# EAGLE schematic RT5350F_OLinuXino_EVB_Rev_C (EAGLE 4.16)
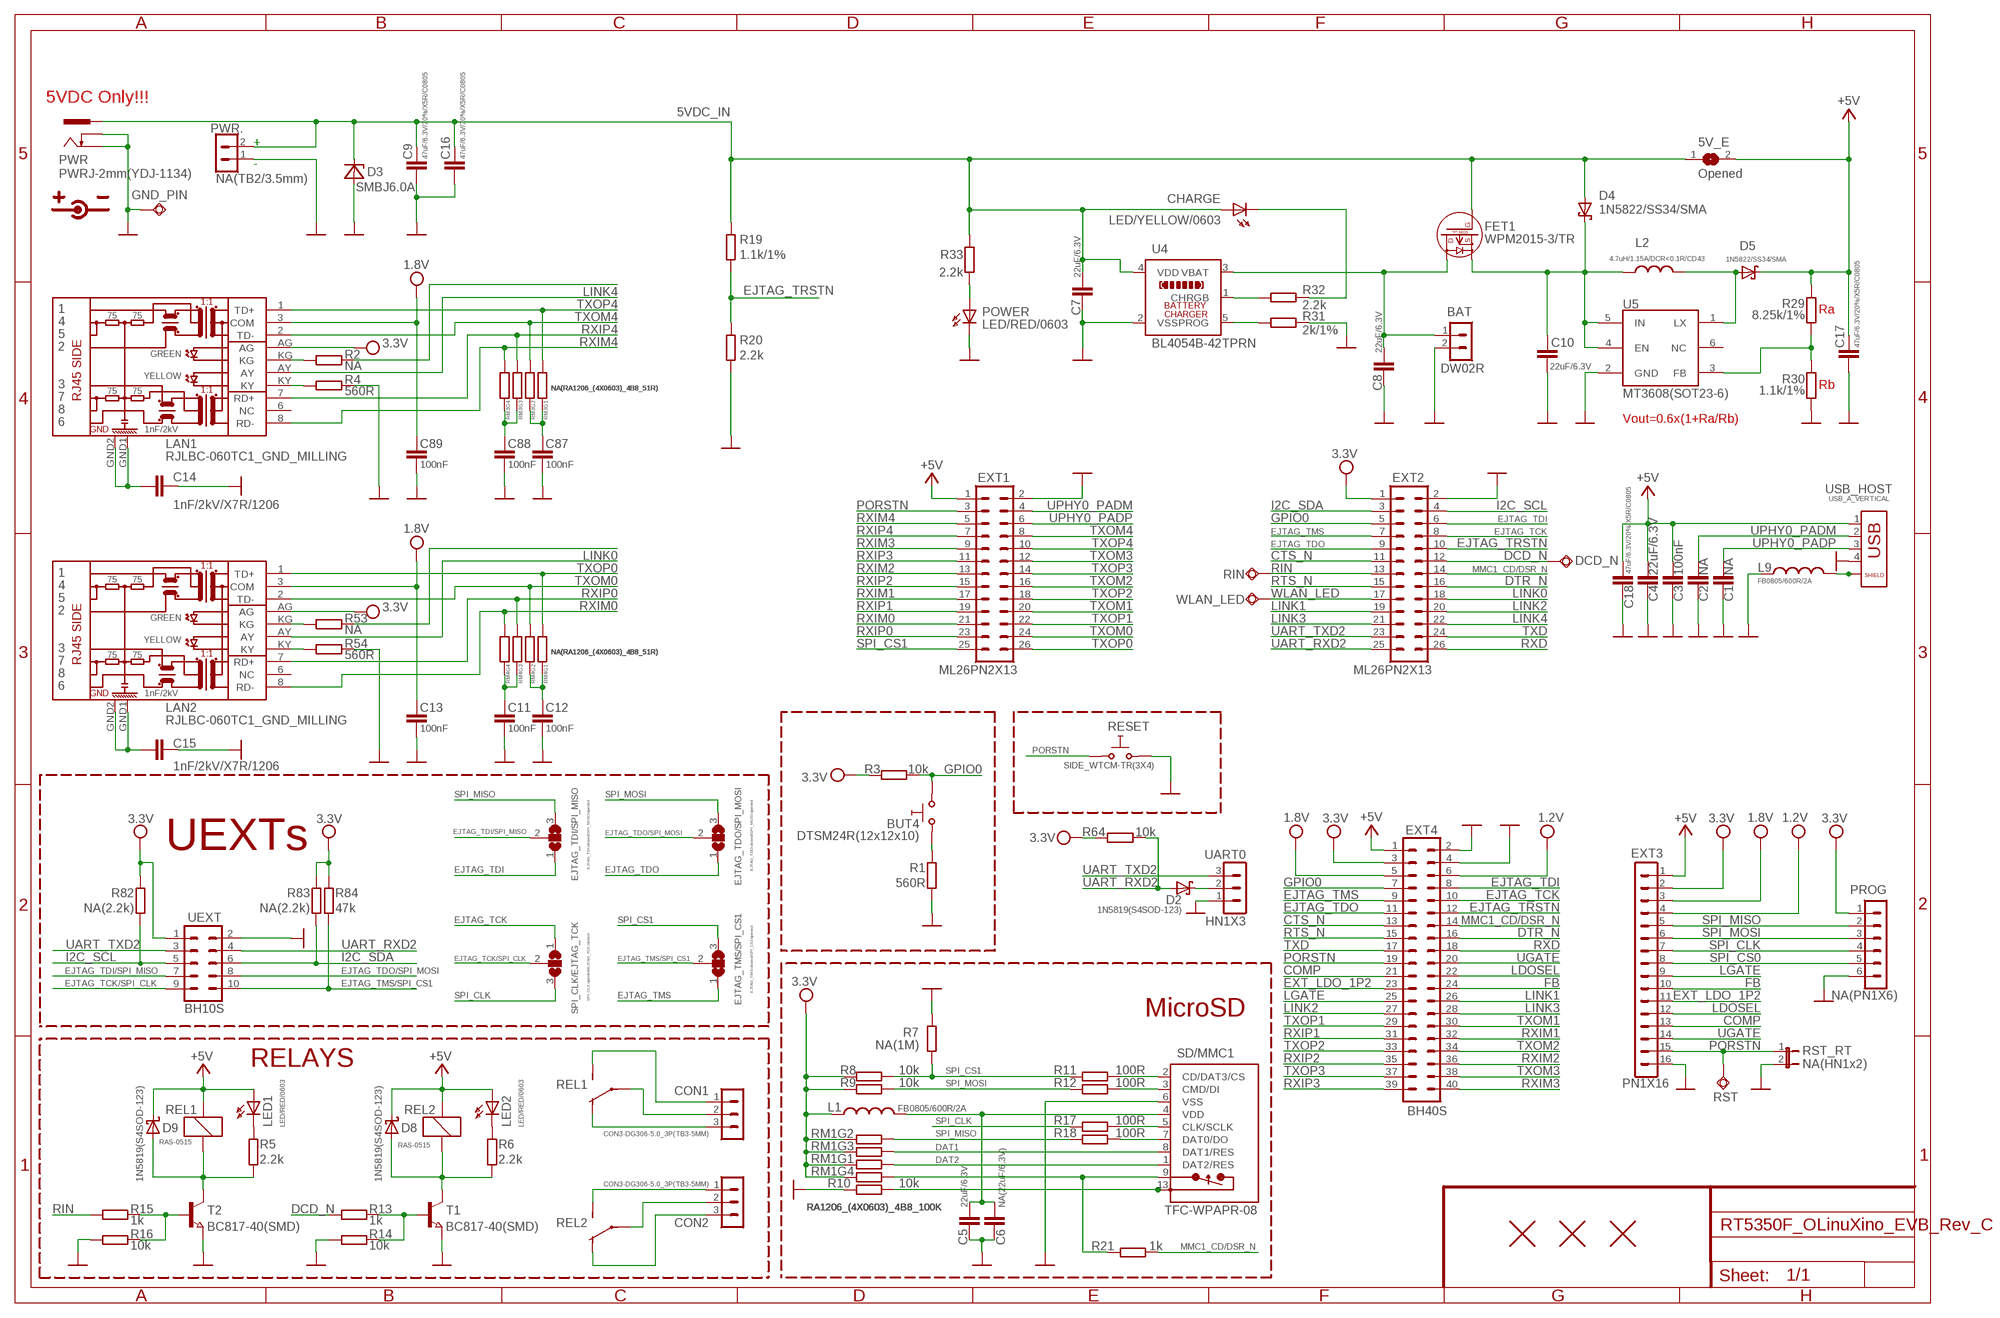
[diagram p0: schematic, sheet 1]

## Parts
5V_E  Opened  SJ_SMALLER  [SJ_1_SMALLER]
BAT  DW02R  CON2DW02R  [DW02R]
BUT4  DTSM24R(12x12x10)  SW-TAKTSS  [SW_TAKT12X12SS]
C1  NA  C-EUC0402_TI  [C0402_TI]
C2  NA  C-EUC0402_TI  [C0402_TI]
C3  100nF  C-EUC0603_DWS  [C0603_DWS]
C4  22uF/6.3V  C-EUC0603_DWS  [C0603_DWS]
C5  22uF/6.3V  C-EUC0603_DWS  [C0603_DWS]
C6  NA(22uF/6.3V)  C-EUC0603_DWS  [C0603_DWS]
C7  22uF/6.3V  C-EUC0603_DWS  [C0603_DWS]
C8  22uF/6.3V  C-EUC0603_DWS  [C0603_DWS]
C9  47uF/6.3V/20%/X5R/C0805  C-EUC0805_5MIL_DWS  [C0805_5MIL_DWS]
C10  22uF/6.3V  C-EUC0603_DWS  [C0603_DWS]
C11  100nF  C-EUC0603_DWS  [C0603_DWS]
C12  100nF  C-EUC0603_DWS  [C0603_DWS]
C13  100nF  C-EUC0603_DWS  [C0603_DWS]
C14  1nF/2kV/X7R/1206  C-EUC1206_5MILS_WS_ISO  [C1206_5MILS_WS_ISO]
C15  1nF/2kV/X7R/1206  C-EUC1206_5MILS_WS_ISO  [C1206_5MILS_WS_ISO]
C16  47uF/6.3V/20%/X5R/C0805  C-EUC0805_5MIL_DWS  [C0805_5MIL_DWS]
C17  47uF/6.3V/20%/X5R/C0805  C-EUC0805_5MIL_DWS  [C0805_5MIL_DWS]
C18  47uF/6.3V/20%/X5R/C0805  C-EUC0805_5MIL_DWS  [C0805_5MIL_DWS]
C87  100nF  C-EUC0603_DWS  [C0603_DWS]
C88  100nF  C-EUC0603_DWS  [C0603_DWS]
C89  100nF  C-EUC0603_DWS  [C0603_DWS]
CHARGE  LED/YELLOW/0603  LED0603DWS  [LED-0603]
CON1  CON3-DG306-5.0_3P(TB3-5MM)  [DG306-5.0_3P]
CON2  CON3-DG306-5.0_3P(TB3-5MM)  [DG306-5.0_3P]
D2  1N5819(S4SOD-123)  SCHOTKKY7.62SS-1N5819(S4SOD-123)  [SOD-123]
D3  SMBJ6.0A  SMBJ16A  [DO214AA]
D4  1N5822/SS34/SMA  SCHOTKKY7.62SS2  [MLL-41]
D5  1N5822/SS34/SMA  SCHOTKKY7.62SS2  [MLL-41]
D8  1N5819(S4SOD-123)  SCHOTKKY7.62SS-1N5819(S4SOD-123)  [SOD-123]
D9  1N5819(S4SOD-123)  SCHOTKKY7.62SS-1N5819(S4SOD-123)  [SOD-123]
DCD_N  TESTPAD40/70  [TESTPAD]
EJTAG_TDI/SPI_MISO  EJTAG_TDI:closed/SPI_MISO:opened  SJ2W3  [SJ_2_SMALL]
EJTAG_TDO/SPI_MOSI  EJTAG_TDO:closed/SPI_MOSI:opened  SJ2W3  [SJ_2_SMALL]
EJTAG_TMS/SPI_CS1  EJTAG_TMS:closed/SPI_CS1:opened  SJ2W3  [SJ_2_SMALL]
EXT1  ML26PN2X13  [PN2X13]
EXT2  ML26PN2X13  [PN2X13]
EXT3  PN1X16  CON16-HN1X16  [HN1X16]
EXT4  BH40S  ML40  [ML40]
FET1  WPM2015-3/TR  P-MOS+DIODIRLML6402  [SOT23]
GND_PIN  TESTPAD3  [TEST_PAD40/70/SQUARE]
L1  FB0805/600R/2A  L-USL0805_5MIL_DWS  [L0805_5MIL_DWS]
L2  4.7uH/1.15A/DCR<0.1R/CD43  L-CD42(43)  [CD42(43)]
L9  FB0805/600R/2A  L-USL0805_5MIL_DWS  [L0805_5MIL_DWS]
LAN1  RJLBC-060TC1_GND_MILLING  [RJLBC-060TC1_MILLING]
LAN2  RJLBC-060TC1_GND_MILLING  [RJLBC-060TC1_MILLING]
LED1  LED/RED/0603  LED0603DWS  [LED-0603]
LED2  LED/RED/0603  LED0603DWS  [LED-0603]
POWER  LED/RED/0603  LED0603DWS  [LED-0603]
PROG  NA(PN1X6)  CON6PN1X6  [PN1X6]
PWR  PWRJ-2mm(YDJ-1134)  PWR-JAKPWR_JACK_UNI_MILLING  [PWR_JACK_UNI_MILLING]
PWR.  NA(TB2/3.5mm)  CON2-DG306-5.0_2P(TB2-5MM)  [DG306-5.0_2P]
R1  560R  R-EU_R0603_5MIL_DWS  [R0603_5MIL_DWS]
R2  NA  R-EU_R0603_5MIL_DWS  [R0603_5MIL_DWS]
R3  10k  R-EU_R0603_5MIL_DWS  [R0603_5MIL_DWS]
R4  560R  R-EU_R0603_5MIL_DWS  [R0603_5MIL_DWS]
R5  2.2k  R-EU_R0603_5MIL_DWS  [R0603_5MIL_DWS]
R6  2.2k  R-EU_R0603_5MIL_DWS  [R0603_5MIL_DWS]
R7  NA(1M)  R-EU_R0603_5MIL_DWS  [R0603_5MIL_DWS]
R8  10k  R-EU_R0603_5MIL_DWS  [R0603_5MIL_DWS]
R9  10k  R-EU_R0603_5MIL_DWS  [R0603_5MIL_DWS]
R10  10k  R-EU_R0603_5MIL_DWS  [R0603_5MIL_DWS]
R11  100R  R-EU_R0603_5MIL_DWS  [R0603_5MIL_DWS]
R12  100R  R-EU_R0603_5MIL_DWS  [R0603_5MIL_DWS]
R13  1k  R-EU_R0603_5MIL_DWS  [R0603_5MIL_DWS]
R14  10k  R-EU_R0603_5MIL_DWS  [R0603_5MIL_DWS]
R15  1k  R-EU_R0603_5MIL_DWS  [R0603_5MIL_DWS]
R16  10k  R-EU_R0603_5MIL_DWS  [R0603_5MIL_DWS]
R17  100R  R-EU_R0603_5MIL_DWS  [R0603_5MIL_DWS]
R18  100R  R-EU_R0603_5MIL_DWS  [R0603_5MIL_DWS]
R19  1.1k/1%  R-EU_R0603_5MIL_DWS  [R0603_5MIL_DWS]
R20  2.2k  R-EU_R0603_5MIL_DWS  [R0603_5MIL_DWS]
R21  1k  R-EU_R0603_5MIL_DWS  [R0603_5MIL_DWS]
R29  8.25k/1%  R-EU_R0603_5MIL_DWS  [R0603_5MIL_DWS]
R30  1.1k/1%  R-EU_R0603_5MIL_DWS  [R0603_5MIL_DWS]
R31  2k/1%  R-EU_R0603_5MIL_DWS  [R0603_5MIL_DWS]
R32  2.2k  R-EU_R0603_5MIL_DWS  [R0603_5MIL_DWS]
R33  2.2k  R-EU_R0603_5MIL_DWS  [R0603_5MIL_DWS]
R53  NA  R-EU_R0603_5MIL_DWS  [R0603_5MIL_DWS]
R54  560R  R-EU_R0603_5MIL_DWS  [R0603_5MIL_DWS]
R64  10k  R-EU_R0603_5MIL_DWS  [R0603_5MIL_DWS]
R82  NA(2.2k)  R-EU_R0603_5MIL_DWS  [R0603_5MIL_DWS]
R83  NA(2.2k)  R-EU_R0603_5MIL_DWS  [R0603_5MIL_DWS]
R84  47k  R-EU_R0603_5MIL_DWS  [R0603_5MIL_DWS]
REL1  RAS-0515  RELAYH200F  [H200-FAT]
REL2  RAS-0515  RELAYH200F  [H200-FAT]
RESET  SIDE_WTCM-TR(3X4)  SW-TAKTSIDE_WTCM-TR(3X4)  [SW_TAKT3X4]
RIN  TESTPAD40/70  [TESTPAD]
RM1  RA1206_(4X0603)_4B8_100K  R_MATRIX_4E  [R_MATRIX_4]
RM3  NA(RA1206_(4X0603)_4B8_51R)  R_MATRIX_4E  [R_MATRIX_4]
RM4  NA(RA1206_(4X0603)_4B8_51R)  R_MATRIX_4E  [R_MATRIX_4]
RST  TESTPAD3  [TEST_PAD40/70/SQUARE]
RST_RT  NA(HN1x2)  JP1E  [JP1]
SD/MMC1  TFC-WPAPR-08  MICRO_SD/MMC_CP_NEWTFC-WPAPR-08  [TFC-WPAPR-08]
SPI_CLK/EJTAG_TCK  SPI_CLK:opened/EJTAG_TCK:closed  SJ2W3  [SJ_2_SMALL]
T1  BC817-40(SMD)  NPN-TRANSISTOR_SOT23  [SOT23]
T2  BC817-40(SMD)  NPN-TRANSISTOR_SOT23  [SOT23]
U1  FIDUCIAL  [FIDUCIAL-1X3]
U2  FIDUCIAL  [FIDUCIAL-1X3]
U3  FIDUCIAL  [FIDUCIAL-1X3]
U4  BL4054B-42TPRN  [SOT23-5]
U5  MT3608(SOT23-6)  SY7208  [SOT23-6]
UART0  HN1X3  CON3HN1X3  [HN1X3]
UEXT  BH10S  ML10  [ML10-MALE]
USB_HOST  USB_A_VERTICAL  USB_SHIELDUSB_A_VERTICAL  [USB_A_VERTICAL_PTH]
WLAN_LED  TESTPAD40/70  [TESTPAD]

## Nets
5VDC_IN: 5V_E.1 C7.1 C9.1 C16.1 CHARGE.A D3.C D4.A FET1.1(G) PWR.+ PWR..2 R19.1 R33.1 U4.4(VDD)
+5V: 5V_E.2 C3.1 C4.1 C17.1 C18.1 D5.K(C) D8.C D9.C EXT1.1 EXT3.1 EXT4.1 LED1.A LED2.A R29.1 REL1.1 REL2.1 USB_HOST.1
COMP: EXT3.13 EXT4.21
CTS_N: EXT2.11 EXT4.13
DAT1: RM1.3.2 SD/MMC1.8(DAT1/RES)
DAT2: RM1.1.2 SD/MMC1.1(DAT2/RES)
DCD_N: DCD_N.P$1(PP) EXT2.12 R13.2
DTR_N: EXT2.16 EXT4.16
EJTAG_TCK: EXT2.8 EXT4.10 SPI_CLK/EJTAG_TCK.1
EJTAG_TCK/SPI_CLK: SPI_CLK/EJTAG_TCK.2 UEXT.9
EJTAG_TDI: EJTAG_TDI/SPI_MISO.1 EXT2.6 EXT4.8
EJTAG_TDI/SPI_MISO: EJTAG_TDI/SPI_MISO.2 UEXT.7
EJTAG_TDO: EJTAG_TDO/SPI_MOSI.1 EXT2.9 EXT4.11
EJTAG_TDO/SPI_MOSI: EJTAG_TDO/SPI_MOSI.2 UEXT.8
EJTAG_TMS: EJTAG_TMS/SPI_CS1.1 EXT2.7 EXT4.9
EJTAG_TMS/SPI_CS1: EJTAG_TMS/SPI_CS1.2 R84.1 UEXT.10
EJTAG_TRSTN: EXT2.10 EXT4.12 R19.2 R20.1
EXT_LDO_1P2: EXT3.11 EXT4.23
FB: EXT3.10 EXT4.24
GND: BAT.2 C1.2 C2.2 C3.2 C4.2 C5.2 C6.2 C7.2 C8.2 C9.2 C10.2 C11.1 C12.1 C13.1 C14.2 C15.2 C16.2 C17.2 C18.2 C87.1 C88.1 C89.1 D3.A EXT1.2 EXT2.2 EXT3.16 EXT4.2 EXT4.4 GND_PIN.P$1(PP) L9.1 POWER.C PROG.6 PWR.- PWR.-- PWR..1 R1.1 R4.2 R7.1 R10.2 R14.2 R16.2 R20.2 R30.2 R31.2 R54.2 RESET.1_1 RST_RT.2 SD/MMC1.6(VSS) T1.2(E) T2.2(E) U4.2(VSS) U5.2(GND) UART0.1 UEXT.2 USB_HOST.4
GPIO0: BUT4.P$2 EXT2.5 EXT4.7 R3.1
I2C_SCL: EXT2.4 R82.1 UEXT.5
I2C_SDA: EXT2.3 R83.1 UEXT.6
LDOSEL: EXT3.12 EXT4.22
LGATE: EXT3.9 EXT4.25
LINK0: EXT2.18 LAN2.AY
LINK1: EXT2.19 EXT4.26
LINK2: EXT2.20 EXT4.27
LINK3: EXT2.21 EXT4.28
LINK4: EXT2.22 LAN1.AY
MMC1_CD/DSR_N: EXT2.14 EXT4.14 R21.1
N$1: BUT4.P$1 R1.2
N$2: LED1.C R5.2
N$3: L9.2 USB_HOST.P$3 USB_HOST.P$4
N$4: D8.A R6.1 REL2.2 T1.3(C)
N$5: LED2.C R6.2
N$6: D2.C UART0.2
N$7: R21.2 RM1.4.2 SD/MMC1.9(CP_E)
N$8: R11.1 SD/MMC1.2(CD/DAT3/CS)
N$9: R12.1 SD/MMC1.3(CMD/DI)
N$10: R17.1 SD/MMC1.5(CLK/SCLK)
N$11: R13.1 R14.1 T1.1(B)
N$12: R15.1 R16.1 T2.1(B)
N$13: R18.1 SD/MMC1.7(DAT0/DO)
N$14: R10.1 SD/MMC1.10(PACK1) SD/MMC1.11(PACK2) SD/MMC1.12(PACK3) SD/MMC1.13(PACK4)
N$15: C10.1 D4.K(C) FET1.2(S) L2.1 U5.4(EN) U5.5(IN)
N$16: C15.1 LAN2.GND1 LAN2.GND2
N$17: C11.2 RM4.3.2 RM4.4.2
N$18: C12.2 RM4.1.2 RM4.2.2
N$19: C5.1 C6.1 L1.2 SD/MMC1.4(VDD)
N$20: LAN2.KG R53.1
N$21: LAN2.KY R54.1
N$22: R53.2
N$23: C14.1 LAN1.GND1 LAN1.GND2
N$27 [REL]: CON2.2 REL2.P(CONTACTS:P)
N$29: R32.2 U4.1(CHRGB)
N$32: D9.A R5.1 REL1.2 T2.3(C)
N$33: C88.2 RM3.3.2 RM3.4.2
N$34 [REL]: CON1.2 REL1.P(CONTACTS:P)
N$35: D5.A L2.2 U5.1(LX)
N$36: R29.2 R30.1 U5.3(FB)
N$37: R31.1 U4.5(PROG)
N$38: CHARGE.C R32.1
N$42: POWER.A R33.2
N$47: C87.2 RM3.1.2 RM3.2.2
N$53: LAN1.KG R2.1
N$57: LAN1.KY R4.1
N$68: R2.2
PORSTN: EXT1.3 EXT3.15 EXT4.19 RESET.2_1 RST.P$1(PP) RST_RT.1
REL1_NC [REL]: CON1.3 REL1.O(CONTACTS:O)
REL1_NO [REL]: CON1.1 REL1.S(CONTACTS:S)
REL2_NC [REL]: CON2.3 REL2.O(CONTACTS:O)
REL2_NO [REL]: CON2.1 REL2.S(CONTACTS:S)
RIN: EXT2.13 R15.2 RIN.P$1(PP)
RTS_N: EXT2.15 EXT4.15
RXD: EXT2.26 EXT4.18
RXIM0: EXT1.21 LAN2.8(RD-) RM4.4.1
RXIM1: EXT1.17 EXT4.32
RXIM2: EXT1.13 EXT4.36
RXIM3: EXT1.9 EXT4.40
RXIM4: EXT1.5 LAN1.8(RD-) RM3.4.1
RXIP0: EXT1.23 LAN2.7(RD+) RM4.3.1
RXIP1: EXT1.19 EXT4.31
RXIP2: EXT1.15 EXT4.35
RXIP3: EXT1.11 EXT4.39
RXIP4: EXT1.7 LAN1.7(RD+) RM3.3.1
SPI_CLK: EXT3.7 PROG.4 R17.2 SPI_CLK/EJTAG_TCK.3
SPI_CS0: EXT3.8 PROG.5
SPI_CS1: EJTAG_TMS/SPI_CS1.3 EXT1.25 R7.2 R8.1 R11.2
SPI_MISO: EJTAG_TDI/SPI_MISO.3 EXT3.5 PROG.2 R18.2 RM1.2.2
SPI_MOSI: EJTAG_TDO/SPI_MOSI.3 EXT3.6 PROG.3 R9.1 R12.2
TXD: EXT2.24 EXT4.17
TXOM0: EXT1.24 LAN2.2(TD-) RM4.2.1
TXOM1: EXT1.20 EXT4.30
TXOM2: EXT1.16 EXT4.34
TXOM3: EXT1.12 EXT4.38
TXOM4: EXT1.8 LAN1.2(TD-) RM3.2.1
TXOP0: EXT1.26 LAN2.1(TD+) RM4.1.1
TXOP1: EXT1.22 EXT4.29
TXOP2: EXT1.18 EXT4.33
TXOP3: EXT1.14 EXT4.37
TXOP4: EXT1.10 LAN1.1(TD+) RM3.1.1
UART_RXD2: D2.A EXT2.25 R64.1 UEXT.4
UART_TXD2: EXT2.23 UART0.3 UEXT.3
UGATE: EXT3.14 EXT4.20
UPHY0_PADM: C2.1 EXT1.4 USB_HOST.2
UPHY0_PADP: C1.1 EXT1.6 USB_HOST.3
VBAT: BAT.1 C8.1 FET1.3(D) U4.3(VBAT)
VCC: EXT2.1 EXT3.2 EXT4.3 L1.1 LAN1.AG LAN2.AG PROG.1 R3.2 R8.2 R9.2 R64.2 R82.2 R83.2 R84.2 RM1.1.1 RM1.2.1 RM1.3.1 RM1.4.1 UEXT.1 ; supply symbol labelled 3.3V
VEE: EXT3.4 EXT4.6 ; supply symbol labelled 1.2V
VPP: C13.2 C89.2 EXT3.3 EXT4.5 LAN1.3(COM) LAN2.3(COM) ; supply symbol labelled 1.8V
WLAN_LED: EXT2.17 WLAN_LED.P$1(PP)
Unconnected: LAN1.6(NC) LAN2.6(NC) U5.6(NC)

## Notes on the sheet
- 5VDC Only!!!
- +
- -
- Ra
- Rb
- Vout=0.6x(1+Ra/Rb)
- UEXTs
- MicroSD
- RELAYS

## Library data of the parts
5V_E = jumper:SJ_SMALLER
BAT PWR. = Penko:CON2
BUT4 RESET = gogo:SW-TAKT
C1-C18 C87-C89 = rcl:C-EU: CAPACITOR, European symbol
CHARGE LED1 LED2 POWER = DOUBLE-SIDE:LED
CON1 CON2 UART0 = Penko:CON3
D2 D4 D5 D8 D9 = gogo:SCHOTKKY7.62SS
D3 = OLIMEX_DISCRET:SMBJ16A
DCD_N GND_PIN RIN RST WLAN_LED = gogo:TESTPAD: drill 40mils, diameter 70mils
EJTAG_TDI/SPI_MISO EJTAG_TDO/SPI_MOSI EJTAG_TMS/SPI_CS1 SPI_CLK/EJTAG_TCK = jumper:SJ2W: SMD solder JUMPER
EXT1 EXT2 = con-harting-ml:ML26: HARTING
EXT3 = Penko:CON16
EXT4 = con-harting-ml:ML40: HARTING
FET1 = Penko:P-MOS+DIOD
L1 L9 = rcl:L-US: INDUCTOR, American symbol
L2 = OLIMEX_DISCRET:L
LAN1 LAN2 = OLIMEX_CONNECTORS:RJLBC-060TC1_GND
PROG = Penko:CON6: CONNECTORS - 6 PINS
PWR = gogo:PWR-JAK
R1-R21 R29-R33 R53 R54 R64 R82-R84 = rcl:R-EU_: RESISTOR, European symbol
REL1 REL2 = DOUBLE-SIDE:RELAY: RELAY
RM1 RM3 RM4 = OLIMEX_DISCRET:R_MATRIX_4E
RST_RT = jumper:JP1E: JUMPER
SD/MMC1 = OLIMEX_CONNECTORS:MICRO_SD/MMC_CP_NEW
T1 T2 = semicon-smd-ipc:NPN-TRANSISTOR_: NPN TRANSISTOR
U1-U3 = SparkFunEagle-6-6-07:FIDUCIAL: Fiducial Alignment Points Various fiducial points for machine vision alignment.
U4 = OLIMEX_IC:BL4054B-42TPRN
U5 = OLIMEX_IC:SY7208
UEXT = con-harting-ml:ML10: HARTING
USB_HOST = OLIMEX_CONNECTORS:USB_SHIELD

## Net classes
4 REL: width 2.032 mm, drill 2.54 mm